# Altium schematic sheet con-top-j3-0.SchDoc: Connector - J3(Top) 0
size Letter; CheckedBy: E. Chiu; CompanyName: Signal Laboratories, Inc.; DrawnBy: J. Brinton; Engineer: J. Brinton; Address1: 3479 Edison Way; Address2: Menlo Park CA 94025; Address3: +1 (877) 778-8435; Address4: brintonengineering.com; Revision: 1; SheetNumber: 22; SheetTotal: 40
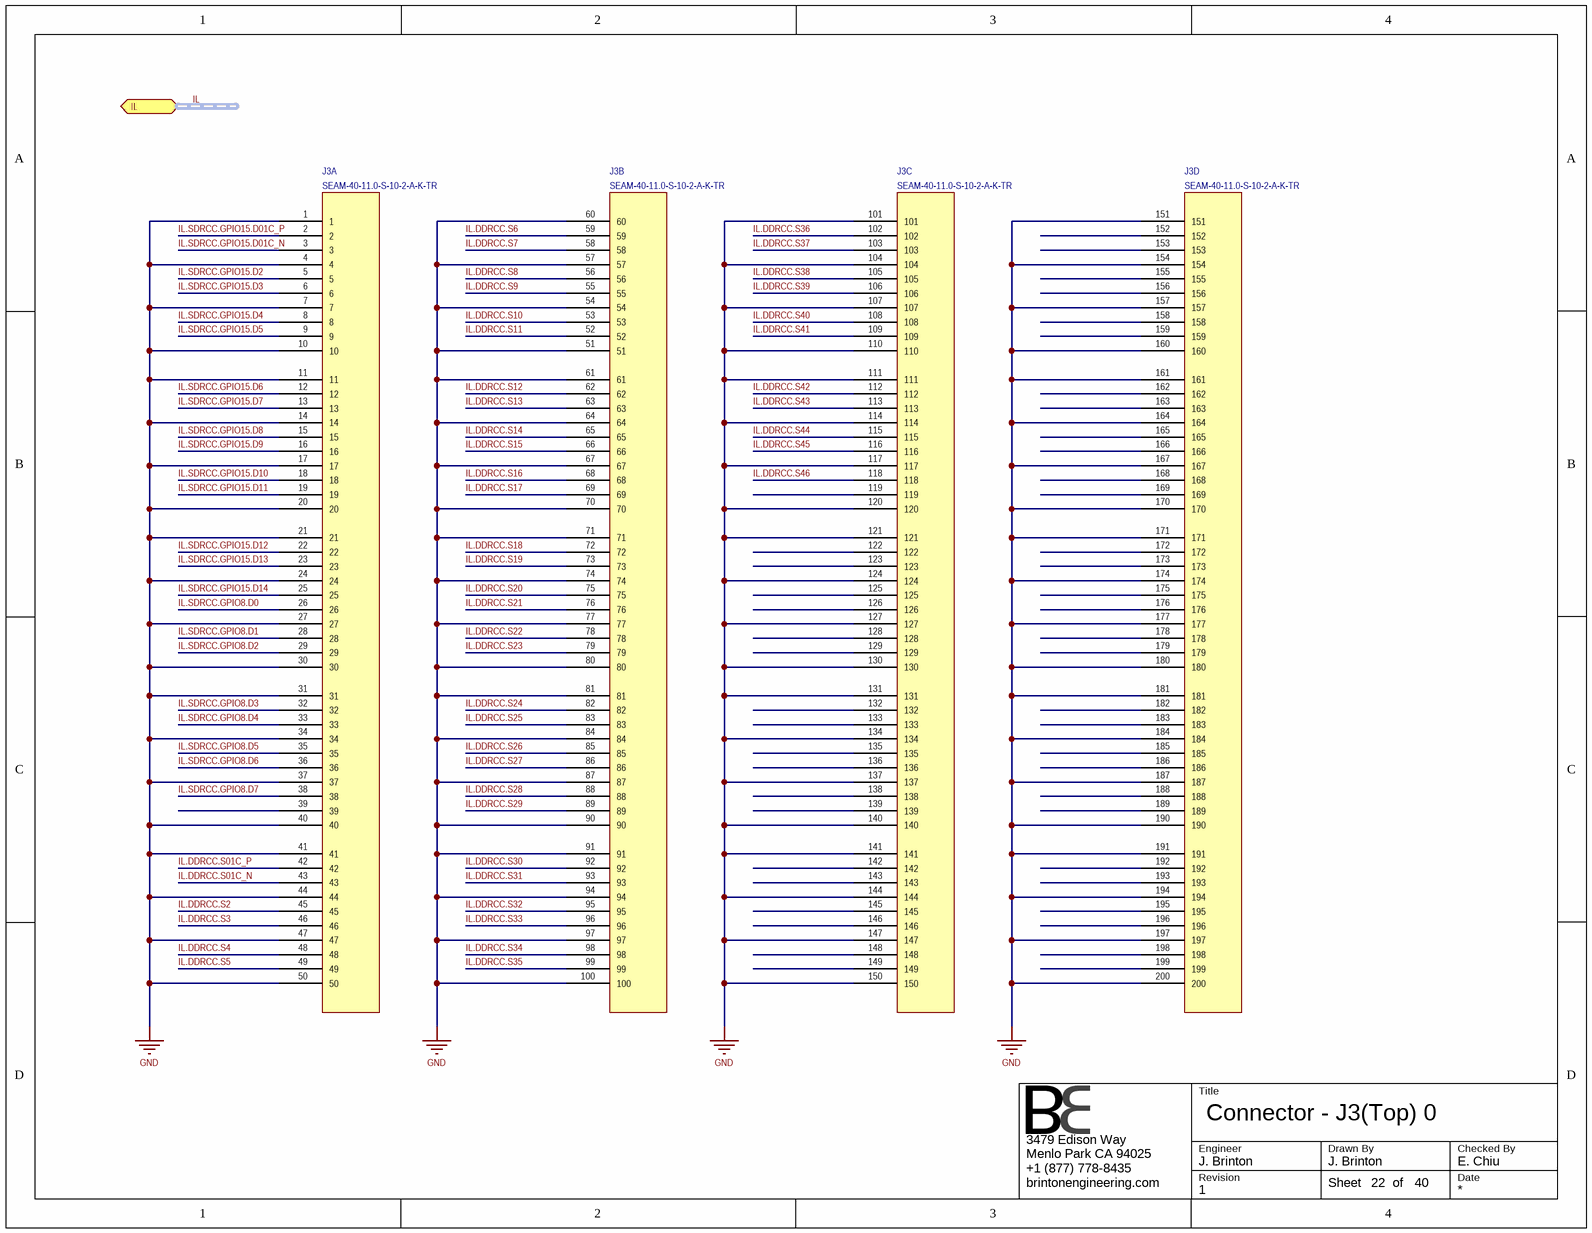
[diagram p0: con-top-j3-0.SchDoc]

## Parts
J3  SEAM-40-11.0-S-10-2-A-K-TR  [SEAM-40-11.0-S-10-2-A-K-TR]  (parts A,B,C,D of 8)

## Ports
IL (harness IL-1V5)

## Nets
GND: J3.1 J3.4 J3.7 J3.10 J3.11 J3.14 J3.17 J3.20 J3.21 J3.24 J3.27 J3.30 J3.31 J3.34 J3.37 J3.40 J3.41 J3.44 J3.47 J3.50 J3.51 J3.54 J3.57 J3.60 J3.61 J3.64 J3.67 J3.70 J3.71 J3.74 J3.77 J3.80 J3.81 J3.84 J3.87 J3.90 J3.91 J3.94 J3.97 J3.100 J3.101 J3.104 J3.107 J3.110 J3.111 J3.114 J3.117 J3.120 J3.121 J3.124 J3.127 J3.130 J3.131 J3.134 J3.137 J3.140 J3.141 J3.144 J3.147 J3.150 J3.151 J3.154 J3.157 J3.160 J3.161 J3.164 J3.167 J3.170 J3.171 J3.174 J3.177 J3.180 J3.181 J3.184 J3.187 J3.190 J3.191 J3.194 J3.197 J3.200
IL.DDRCC.S01C_N: J3.43
IL.DDRCC.S01C_P: J3.42
IL.DDRCC.S2: J3.45
IL.DDRCC.S3: J3.46
IL.DDRCC.S4: J3.48
IL.DDRCC.S5: J3.49
IL.DDRCC.S6: J3.59
IL.DDRCC.S7: J3.58
IL.DDRCC.S8: J3.56
IL.DDRCC.S9: J3.55
IL.DDRCC.S10: J3.53
IL.DDRCC.S11: J3.52
IL.DDRCC.S12: J3.62
IL.DDRCC.S13: J3.63
IL.DDRCC.S14: J3.65
IL.DDRCC.S15: J3.66
IL.DDRCC.S16: J3.68
IL.DDRCC.S17: J3.69
IL.DDRCC.S18: J3.72
IL.DDRCC.S19: J3.73
IL.DDRCC.S20: J3.75
IL.DDRCC.S21: J3.76
IL.DDRCC.S22: J3.78
IL.DDRCC.S23: J3.79
IL.DDRCC.S24: J3.82
IL.DDRCC.S25: J3.83
IL.DDRCC.S26: J3.85
IL.DDRCC.S27: J3.86
IL.DDRCC.S28: J3.88
IL.DDRCC.S29: J3.89
IL.DDRCC.S30: J3.92
IL.DDRCC.S31: J3.93
IL.DDRCC.S32: J3.95
IL.DDRCC.S33: J3.96
IL.DDRCC.S34: J3.98
IL.DDRCC.S35: J3.99
IL.DDRCC.S36: J3.102
IL.DDRCC.S37: J3.103
IL.DDRCC.S38: J3.105
IL.DDRCC.S39: J3.106
IL.DDRCC.S40: J3.108
IL.DDRCC.S41: J3.109
IL.DDRCC.S42: J3.112
IL.DDRCC.S43: J3.113
IL.DDRCC.S44: J3.115
IL.DDRCC.S45: J3.116
IL.DDRCC.S46: J3.118
IL.SDRCC.GPIO8.D0: J3.26
IL.SDRCC.GPIO8.D1: J3.28
IL.SDRCC.GPIO8.D2: J3.29
IL.SDRCC.GPIO8.D3: J3.32
IL.SDRCC.GPIO8.D4: J3.33
IL.SDRCC.GPIO8.D5: J3.35
IL.SDRCC.GPIO8.D6: J3.36
IL.SDRCC.GPIO8.D7: J3.38
IL.SDRCC.GPIO15.D01C_N: J3.3
IL.SDRCC.GPIO15.D01C_P: J3.2
IL.SDRCC.GPIO15.D2: J3.5
IL.SDRCC.GPIO15.D3: J3.6
IL.SDRCC.GPIO15.D4: J3.8
IL.SDRCC.GPIO15.D5: J3.9
IL.SDRCC.GPIO15.D6: J3.12
IL.SDRCC.GPIO15.D7: J3.13
IL.SDRCC.GPIO15.D8: J3.15
IL.SDRCC.GPIO15.D9: J3.16
IL.SDRCC.GPIO15.D10: J3.18
IL.SDRCC.GPIO15.D11: J3.19
IL.SDRCC.GPIO15.D12: J3.22
IL.SDRCC.GPIO15.D13: J3.23
IL.SDRCC.GPIO15.D14: J3.25

Not connected (* = marked no-connect by the designer): J3 39 119 122 123 125 126 128 129 132 133 135 136 138 139 142 143 145 146 148 149 152 153 155 156 158 159 162 163 165 166 168 169 172 173 175 176 178 179 182 183 185 186 188 189 192 193 195 196 198 199

## Buses and harness runs
harness IL = port IL

## Notes on the sheet
- Title
- Engineer
- Revision
- Drawn By
- Checked By
- Date
- Sheet
- of

## Library data of the parts
J3 = SEAM-40-11.0-S-10-2-A-K-TR: Terminal Array Assembly, Surface Mount, 0.050" Pitch, 400 Pins; Manufacturer: Samtec; Manufacturer P/N: SEAM-40-11.0-S-10-2-A-K-TR